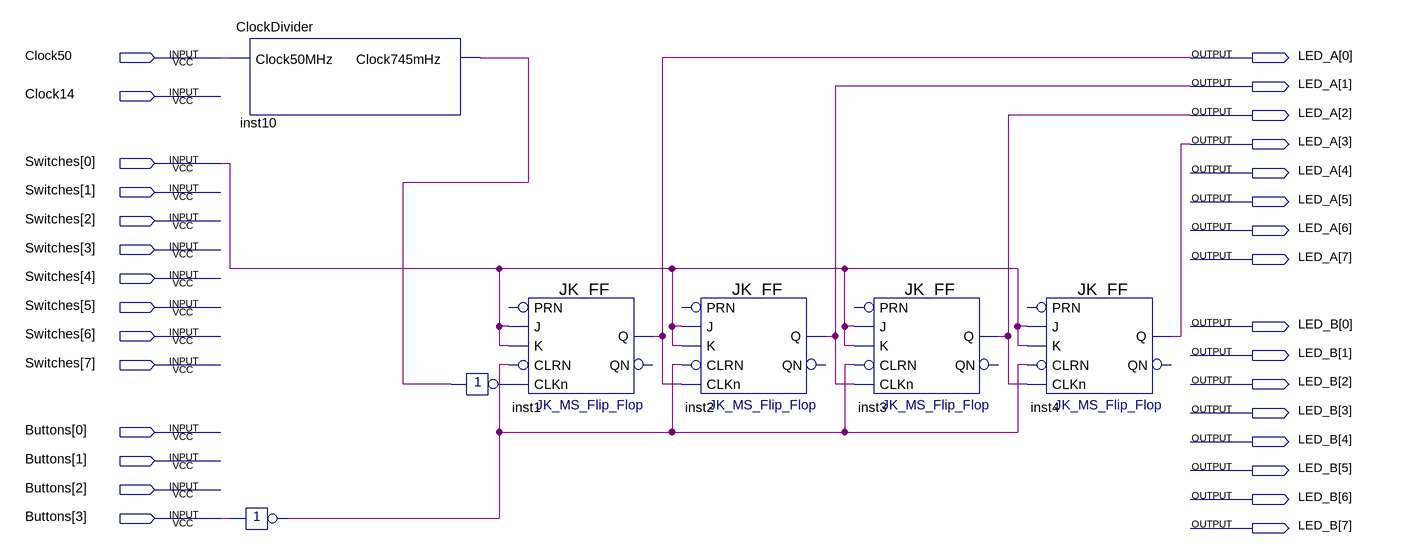
[diagram p0: schematic sheet]
// Quartus schematic Asynchronzaehler.bdf as structural Verilog: 7 symbols, 30 pins
module Asynchronzaehler (
  input  Clock50,
  input  Clock14,
  input  [7:0] Switches,
  input  [3:0] Buttons,
  output [7:0] LED_A,
  output [7:0] LED_B
);

  wire inst5_out, inst6_out, inst10_clock745mhz;

  ClockDivider inst10 (.Clock50MHz(Clock50), .Clock745mHz(inst10_clock745mhz));
  not inst6 (inst6_out, Buttons[3]);
  not inst5 (inst5_out, inst10_clock745mhz);
  JK_FF inst1 (.K(Switches[0]), .J(Switches[0]), .CLRN(inst6_out), .CLKn(inst5_out), .Q(LED_A[0]));  // open: PRN, QN
  JK_FF inst2 (.K(Switches[0]), .J(Switches[0]), .CLRN(inst6_out), .CLKn(LED_A[0]), .Q(LED_A[1]));  // open: PRN, QN
  JK_FF inst3 (.K(Switches[0]), .J(Switches[0]), .CLRN(inst6_out), .CLKn(LED_A[1]), .Q(LED_A[2]));  // open: PRN, QN
  JK_FF inst4 (.K(Switches[0]), .J(Switches[0]), .CLRN(inst6_out), .CLKn(LED_A[2]), .Q(LED_A[3]));  // open: PRN, QN
endmodule
